# EAGLE schematic TestPlatform (EAGLE 9.6.2)
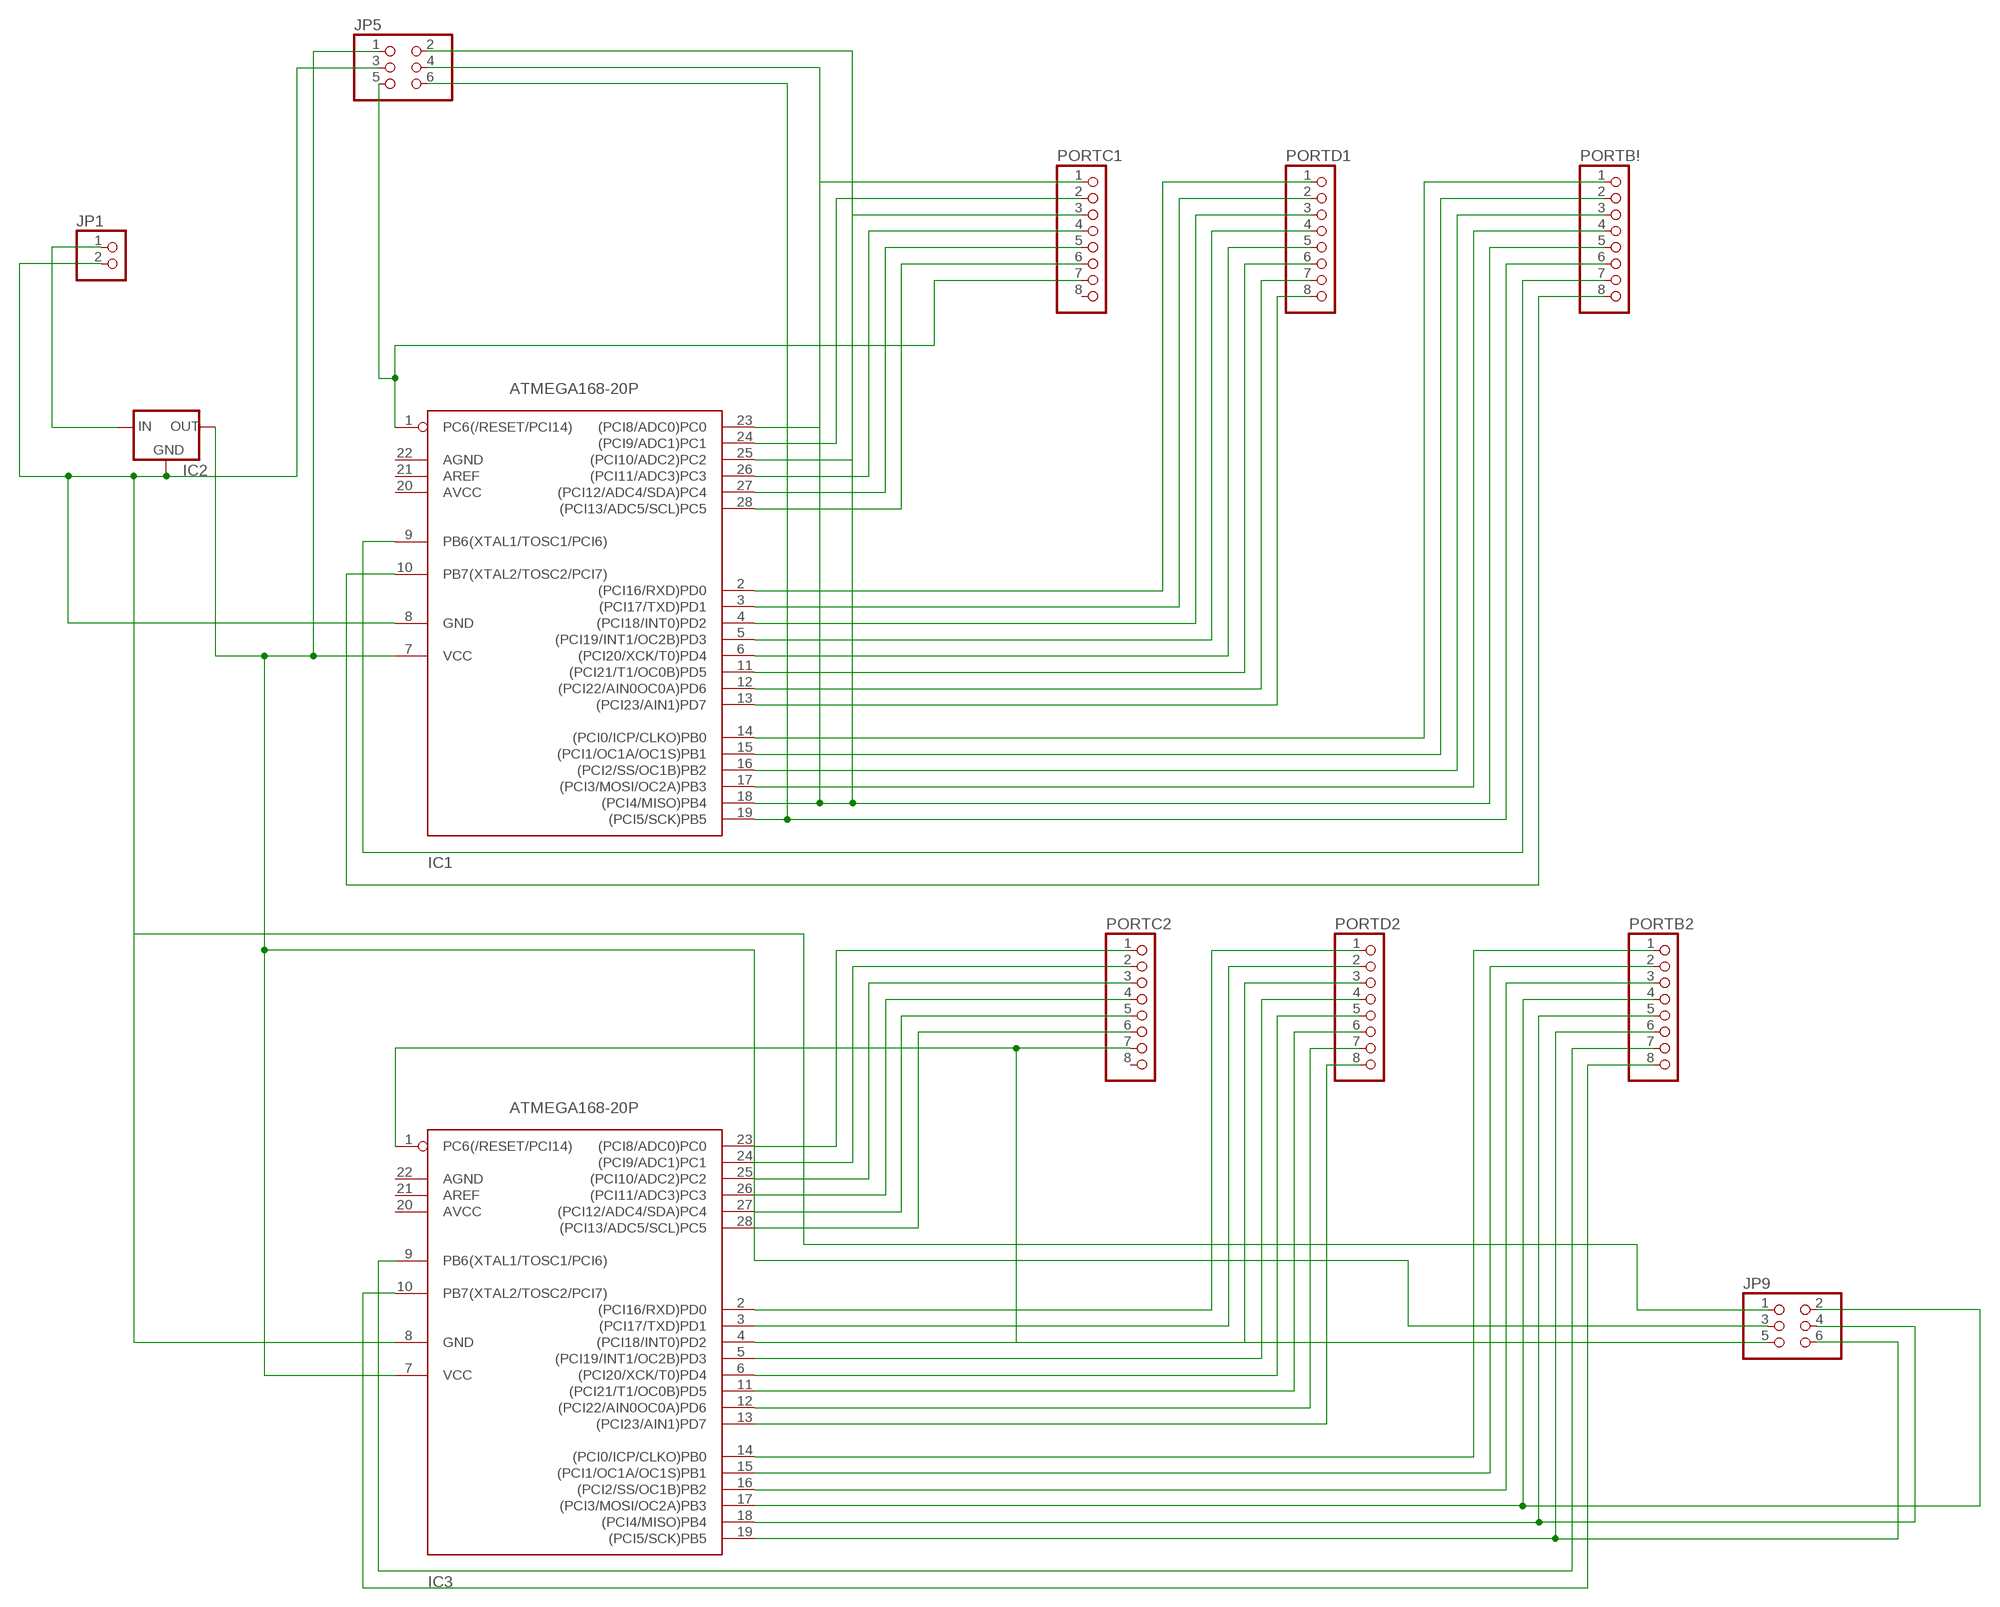
[diagram p0: schematic, sheet 1]

## Parts
IC1  ATMEGA168-20P  [DIL28-3]
IC2  78XXL  [78XXL]
IC3  ATMEGA168-20P  [DIL28-3]
JP1  PINHD-1X2  [1X02]
JP5  PINHD-2X3  [2X03]
JP9  PINHD-2X3  [2X03]
PORTB2  PINHD-1X8  [1X08]
PORTB!  PINHD-1X8  [1X08]
PORTC1  PINHD-1X8  [1X08]
PORTC2  PINHD-1X8  [1X08]
PORTD1  PINHD-1X8  [1X08]
PORTD2  PINHD-1X8  [1X08]

## Nets
N$1: IC1.8(GND) IC2.GND IC3.8(GND) JP1.2 JP5.3 JP9.1
N$2: IC2.IN JP1.1
N$4: IC1.2((PCI16/RXD)PD0) PORTD1.1
N$5: IC1.3((PCI17/TXD)PD1) PORTD1.2
N$6: IC1.4((PCI18/INT0)PD2) PORTD1.3
N$7: IC1.5((PCI19/INT1/OC2B)PD3) PORTD1.4
N$8: IC1.6((PCI20/XCK/T0)PD4) PORTD1.5
N$9: IC1.11((PCI21/T1/OC0B)PD5) PORTD1.6
N$10: IC1.12((PCI22/AIN0OC0A)PD6) PORTD1.7
N$11: IC1.13((PCI23/AIN1)PD7) PORTD1.8
N$12: IC1.14((PCI0/ICP/CLKO)PB0) PORTB!.1
N$13: IC1.15((PCI1/OC1A/OC1S)PB1) PORTB!.2
N$14: IC1.16((PCI2/SS/OC1B)PB2) PORTB!.3
N$15: IC1.17((PCI3/MOSI/OC2A)PB3) PORTB!.4
N$16: IC1.18((PCI4/MISO)PB4) JP5.2 JP5.4 PORTB!.5
N$17: IC1.19((PCI5/SCK)PB5) JP5.6 PORTB!.6
N$18: IC1.9(PB6(XTAL1/TOSC1/PCI6)) PORTB!.7
N$19: IC1.10(PB7(XTAL2/TOSC2/PCI7)) PORTB!.8
N$20: IC1.23((PCI8/ADC0)PC0) PORTC1.1
N$21: IC1.24((PCI9/ADC1)PC1) PORTC1.2
N$22: IC1.25((PCI10/ADC2)PC2) PORTC1.3
N$23: IC1.26((PCI11/ADC3)PC3) PORTC1.4
N$24: IC1.27((PCI12/ADC4/SDA)PC4) PORTC1.5
N$25: IC1.28((PCI13/ADC5/SCL)PC5) PORTC1.6
N$26: IC1.1(PC6(/RESET/PCI14)) JP5.5 PORTC1.7
N$27: IC3.2((PCI16/RXD)PD0) PORTD2.1
N$28: IC3.3((PCI17/TXD)PD1) PORTD2.2
N$29: IC3.4((PCI18/INT0)PD2) PORTD2.3
N$30: IC3.5((PCI19/INT1/OC2B)PD3) PORTD2.4
N$31: IC3.6((PCI20/XCK/T0)PD4) PORTD2.5
N$32: IC3.11((PCI21/T1/OC0B)PD5) PORTD2.6
N$33: IC3.12((PCI22/AIN0OC0A)PD6) PORTD2.7
N$34: IC3.13((PCI23/AIN1)PD7) PORTD2.8
N$35: IC3.14((PCI0/ICP/CLKO)PB0) PORTB2.1
N$36: IC3.15((PCI1/OC1A/OC1S)PB1) PORTB2.2
N$37: IC3.16((PCI2/SS/OC1B)PB2) PORTB2.3
N$38: IC3.17((PCI3/MOSI/OC2A)PB3) JP9.2 PORTB2.4
N$39: IC3.18((PCI4/MISO)PB4) JP9.4 PORTB2.5
N$40: IC3.19((PCI5/SCK)PB5) JP9.6 PORTB2.6
N$41: IC3.9(PB6(XTAL1/TOSC1/PCI6)) PORTB2.7
N$42: IC3.10(PB7(XTAL2/TOSC2/PCI7)) PORTB2.8
N$43: IC3.23((PCI8/ADC0)PC0) PORTC2.1
N$44: IC3.24((PCI9/ADC1)PC1) PORTC2.2
N$45: IC3.25((PCI10/ADC2)PC2) PORTC2.3
N$46: IC3.26((PCI11/ADC3)PC3) PORTC2.4
N$47: IC3.27((PCI12/ADC4/SDA)PC4) PORTC2.5
N$48: IC3.28((PCI13/ADC5/SCL)PC5) PORTC2.6
N$49: IC3.1(PC6(/RESET/PCI14)) JP9.5 PORTC2.7
N$51: IC1.7(VCC) IC2.OUT IC3.7(VCC) JP5.1 JP9.3
Unconnected: IC1.20(AVCC) IC1.21(AREF) IC1.22(AGND) IC3.20(AVCC) IC3.21(AREF) IC3.22(AGND) PORTC1.8 PORTC2.8

## Library data of the parts
IC1 IC3 = adafruit:ATMEGA168*P: MICROCONTROLLER 16 kBytes FLASH 1 kBytes SRAM 512 Bytes EEPROM USART 8-channel 10 bit ADC
IC2 = v-reg:78XXL: VOLTAGE REGULATOR
JP1 = pinhead:PINHD-1X2: PIN HEADER
JP5 JP9 = pinhead:PINHD-2X3: PIN HEADER
PORTB2 PORTB! PORTC1 PORTC2 PORTD1 PORTD2 = pinhead:PINHD-1X8: PIN HEADER